# EAGLE schematic Programator (EAGLE 7.2.0)
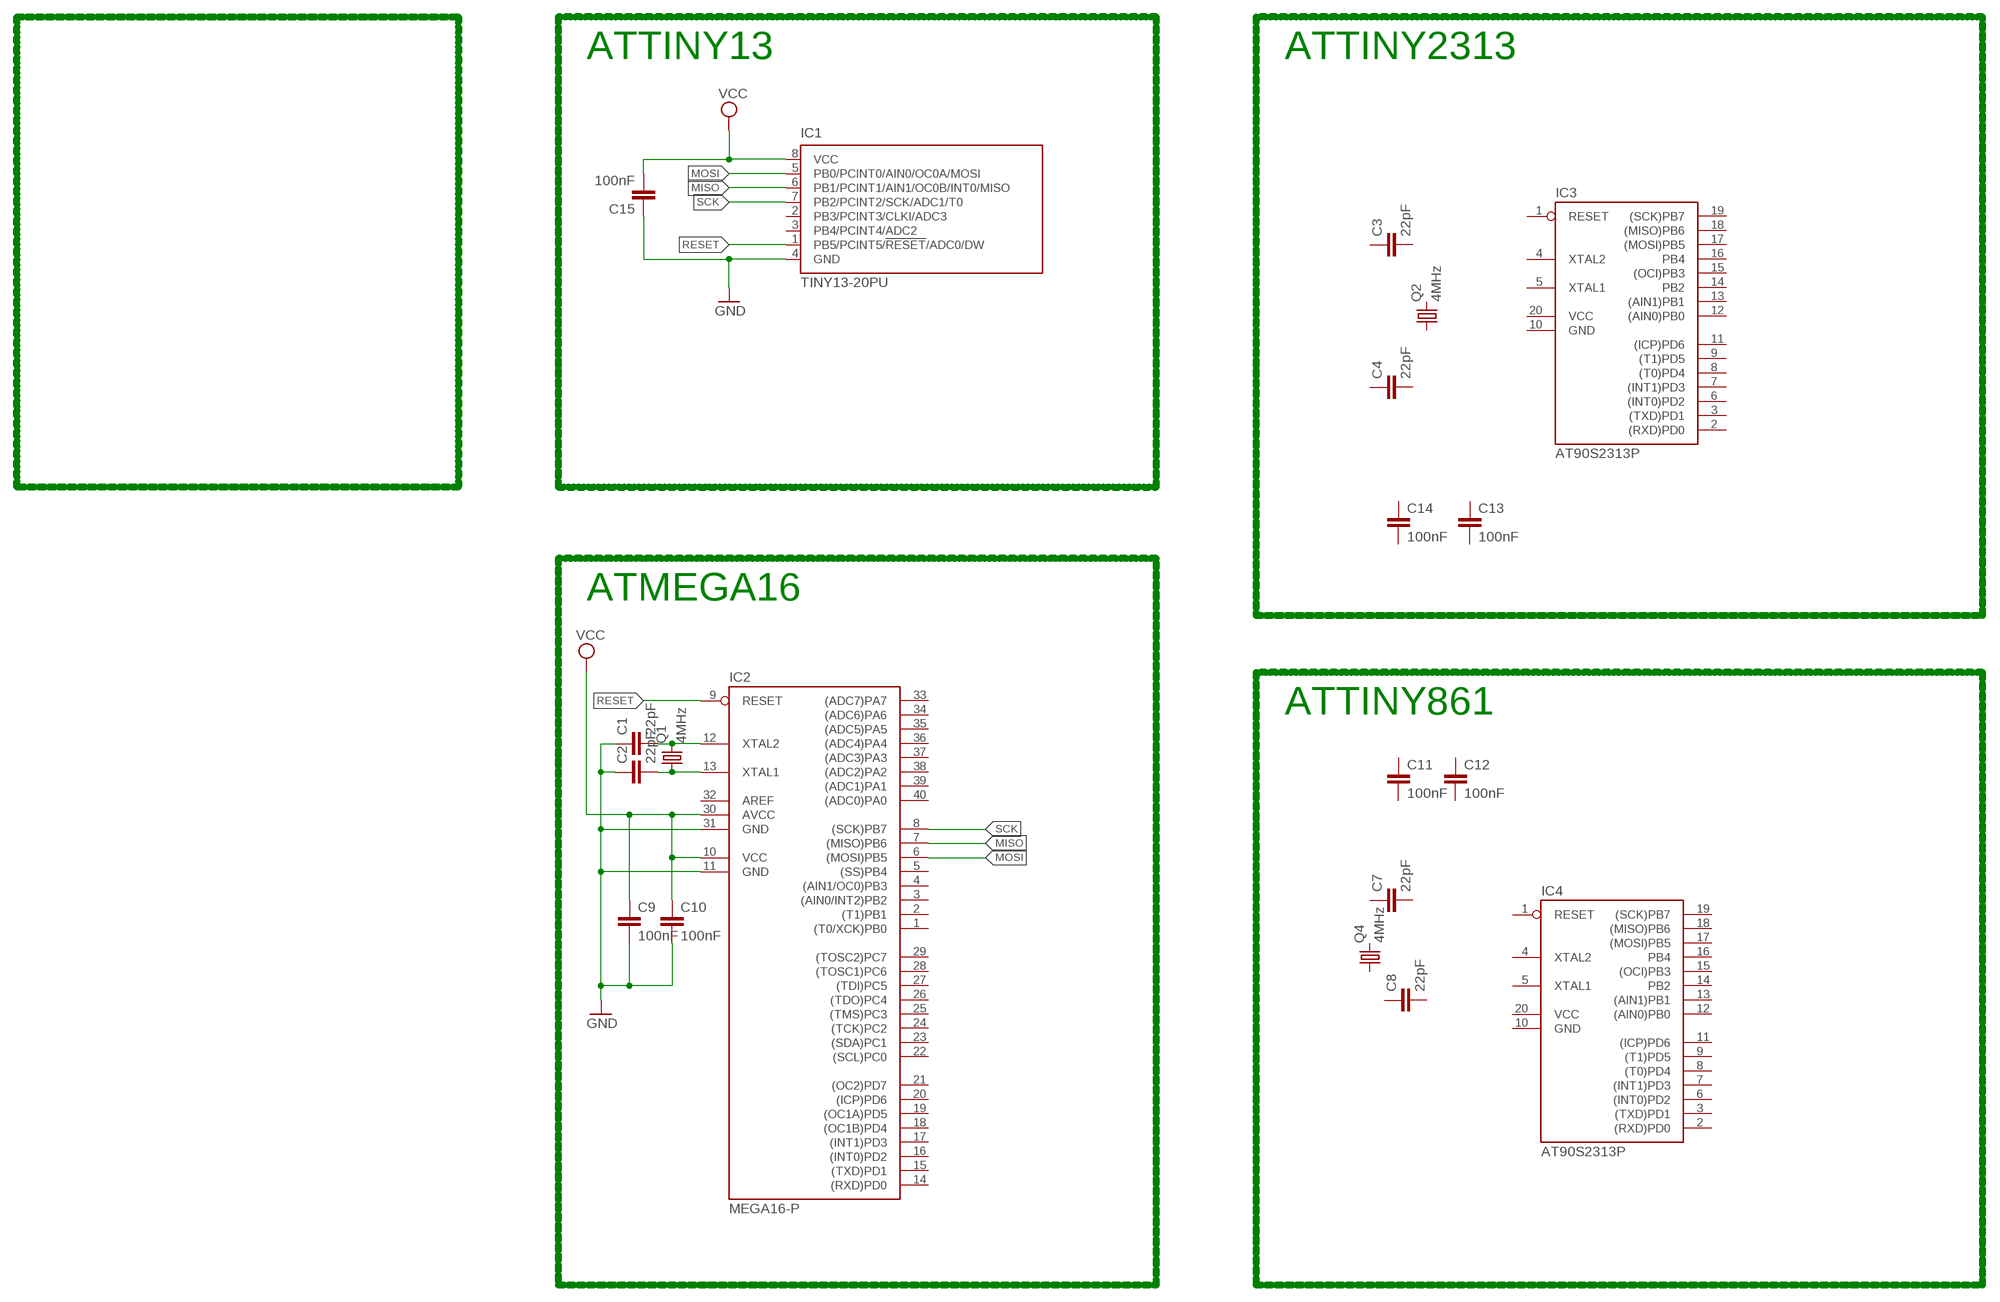
[diagram p0: schematic, sheet 1]

## Parts
C1  22pF  C5/3  [C5B3]
C2  22pF  C5/3  [C5B3]
C3  22pF  C5/3  [C5B3]
C4  22pF  C5/3  [C5B3]
C7  22pF  C5/3  [C5B3]
C8  22pF  C5/3  [C5B3]
C9  100nF  C5/4.5  [C5B4.5]
C10  100nF  C5/4.5  [C5B4.5]
C11  100nF  C5/4.5  [C5B4.5]
C12  100nF  C5/4.5  [C5B4.5]
C13  100nF  C5/4.5  [C5B4.5]
C14  100nF  C5/4.5  [C5B4.5]
C15  100nF  C5/4.5  [C5B4.5]
IC1  TINY13-20PU  [DIL08]
IC2  MEGA16-P  [DIL40]
IC3  AT90S2313P  [DIL20]
IC4  AT90S2313P  [DIL20]
Q1  4MHz  CRYSTALHC49S  [HC49/S]
Q2  4MHz  CRYSTALHC49S  [HC49/S]
Q4  4MHz  CRYSTALHC49S  [HC49/S]

## Nets
GND: C1.1 C2.1 C9.2 C10.2 C15.1 IC1.4(GND) IC2.11(GND) IC2.31(GND)
MISO: IC1.6(PB1/PCINT1/AIN1/OC0B/INT0/MISO) IC2.7((MISO)PB6)
MOSI: IC1.5(PB0/PCINT0/AIN0/OC0A/MOSI) IC2.6((MOSI)PB5)
N$6: C1.2 IC2.12(XTAL2) Q1.2
N$7: C2.2 IC2.13(XTAL1) Q1.1
RESET: IC1.1(PB5/PCINT5/!RESET!/ADC0/DW) IC2.9(RESET)
SCK: IC1.7(PB2/PCINT2/SCK/ADC1/T0) IC2.8((SCK)PB7)
VCC: C9.1 C10.1 C15.2 IC1.8(VCC) IC2.10(VCC) IC2.30(AVCC)
Unconnected: C3.1 C3.2 C4.1 C4.2 C7.1 C7.2 C8.1 C8.2 C11.1 C11.2 C12.1 C12.2 C13.1 C13.2 C14.1 C14.2 IC1.2(PB3/PCINT3/CLKI/ADC3) IC1.3(PB4/PCINT4/ADC2) IC2.1((T0/XCK)PB0) IC2.2((T1)PB1) IC2.3((AIN0/INT2)PB2) IC2.4((AIN1/OC0)PB3) IC2.5((SS)PB4) IC2.14((RXD)PD0) IC2.15((TXD)PD1) IC2.16((INT0)PD2) IC2.17((INT1)PD3) IC2.18((OC1B)PD4) IC2.19((OC1A)PD5) IC2.20((ICP)PD6) IC2.21((OC2)PD7) IC2.22((SCL)PC0) IC2.23((SDA)PC1) IC2.24((TCK)PC2) IC2.25((TMS)PC3) IC2.26((TDO)PC4) IC2.27((TDI)PC5) IC2.28((TOSC1)PC6) IC2.29((TOSC2)PC7) IC2.32(AREF) IC2.33((ADC7)PA7) IC2.34((ADC6)PA6) IC2.35((ADC5)PA5) IC2.36((ADC4)PA4) IC2.37((ADC3)PA3) IC2.38((ADC2)PA2) IC2.39((ADC1)PA1) IC2.40((ADC0)PA0) IC3.1(RESET) IC3.2((RXD)PD0) IC3.3((TXD)PD1) IC3.4(XTAL2) IC3.5(XTAL1) IC3.6((INT0)PD2) IC3.7((INT1)PD3) IC3.8((T0)PD4) IC3.9((T1)PD5) IC3.11((ICP)PD6) IC3.12((AIN0)PB0) IC3.13((AIN1)PB1) IC3.14(PB2) IC3.15((OCI)PB3) IC3.16(PB4) IC3.17((MOSI)PB5) IC3.18((MISO)PB6) IC3.19((SCK)PB7) IC4.1(RESET) IC4.2((RXD)PD0) IC4.3((TXD)PD1) IC4.4(XTAL2) IC4.5(XTAL1) IC4.6((INT0)PD2) IC4.7((INT1)PD3) IC4.8((T0)PD4) IC4.9((T1)PD5) IC4.11((ICP)PD6) IC4.12((AIN0)PB0) IC4.13((AIN1)PB1) IC4.14(PB2) IC4.15((OCI)PB3) IC4.16(PB4) IC4.17((MOSI)PB5) IC4.18((MISO)PB6) IC4.19((SCK)PB7) Q2.1 Q2.2 Q4.1 Q4.2

## Notes on the sheet
- ATTINY13 | ATTINY2313
- ATMEGA16
- ATTINY861

## Power pins joined to a net without a drawn wire
GND: IC3.10(GND) IC4.10(GND)
VCC: IC3.20(VCC) IC4.20(VCC)

## Library data of the parts
C1-C4 C7-C15 = capacitor-wima:C: CAPACITOR naming: grid - package width
IC1 = atmel:TINY13: 8-bit AVR Microcontroller with 1K Bytes In-System Programmable Flash Source: http://www.atmel.com/dyn/resources/prod_documents/2535S.pdf; MPN: ATTINY13-20PU; OC_FARNELL: 9171550; OC_NEWARK: 96K6521
IC2 = atmel:MEGA16-P: MICROCONTROLLER 16 Kbytes FLASH 1 kbytes SRAM 512 bytes EEPROM USART 8-channel 10 bit ADC Source: avr.lbr; MPN: ATMEGA16-16PU; OC_FARNELL: 9171142; OC_NEWARK: 01M6885
IC3 IC4 = atmel:AT90S2313: MICROCONTROLLER 2 Kbytes FLASH 128 bytes SRAM 128 bytes EEPROM UART; OC_FARNELL: unknown; OC_NEWARK: unknown
Q1 Q2 Q4 = crystal:CRYSTAL: CRYSTAL; OC_FARNELL: 1667008; OC_NEWARK: unknown